# EAGLE schematic apvtv_draft1 (EAGLE 8.5.2)
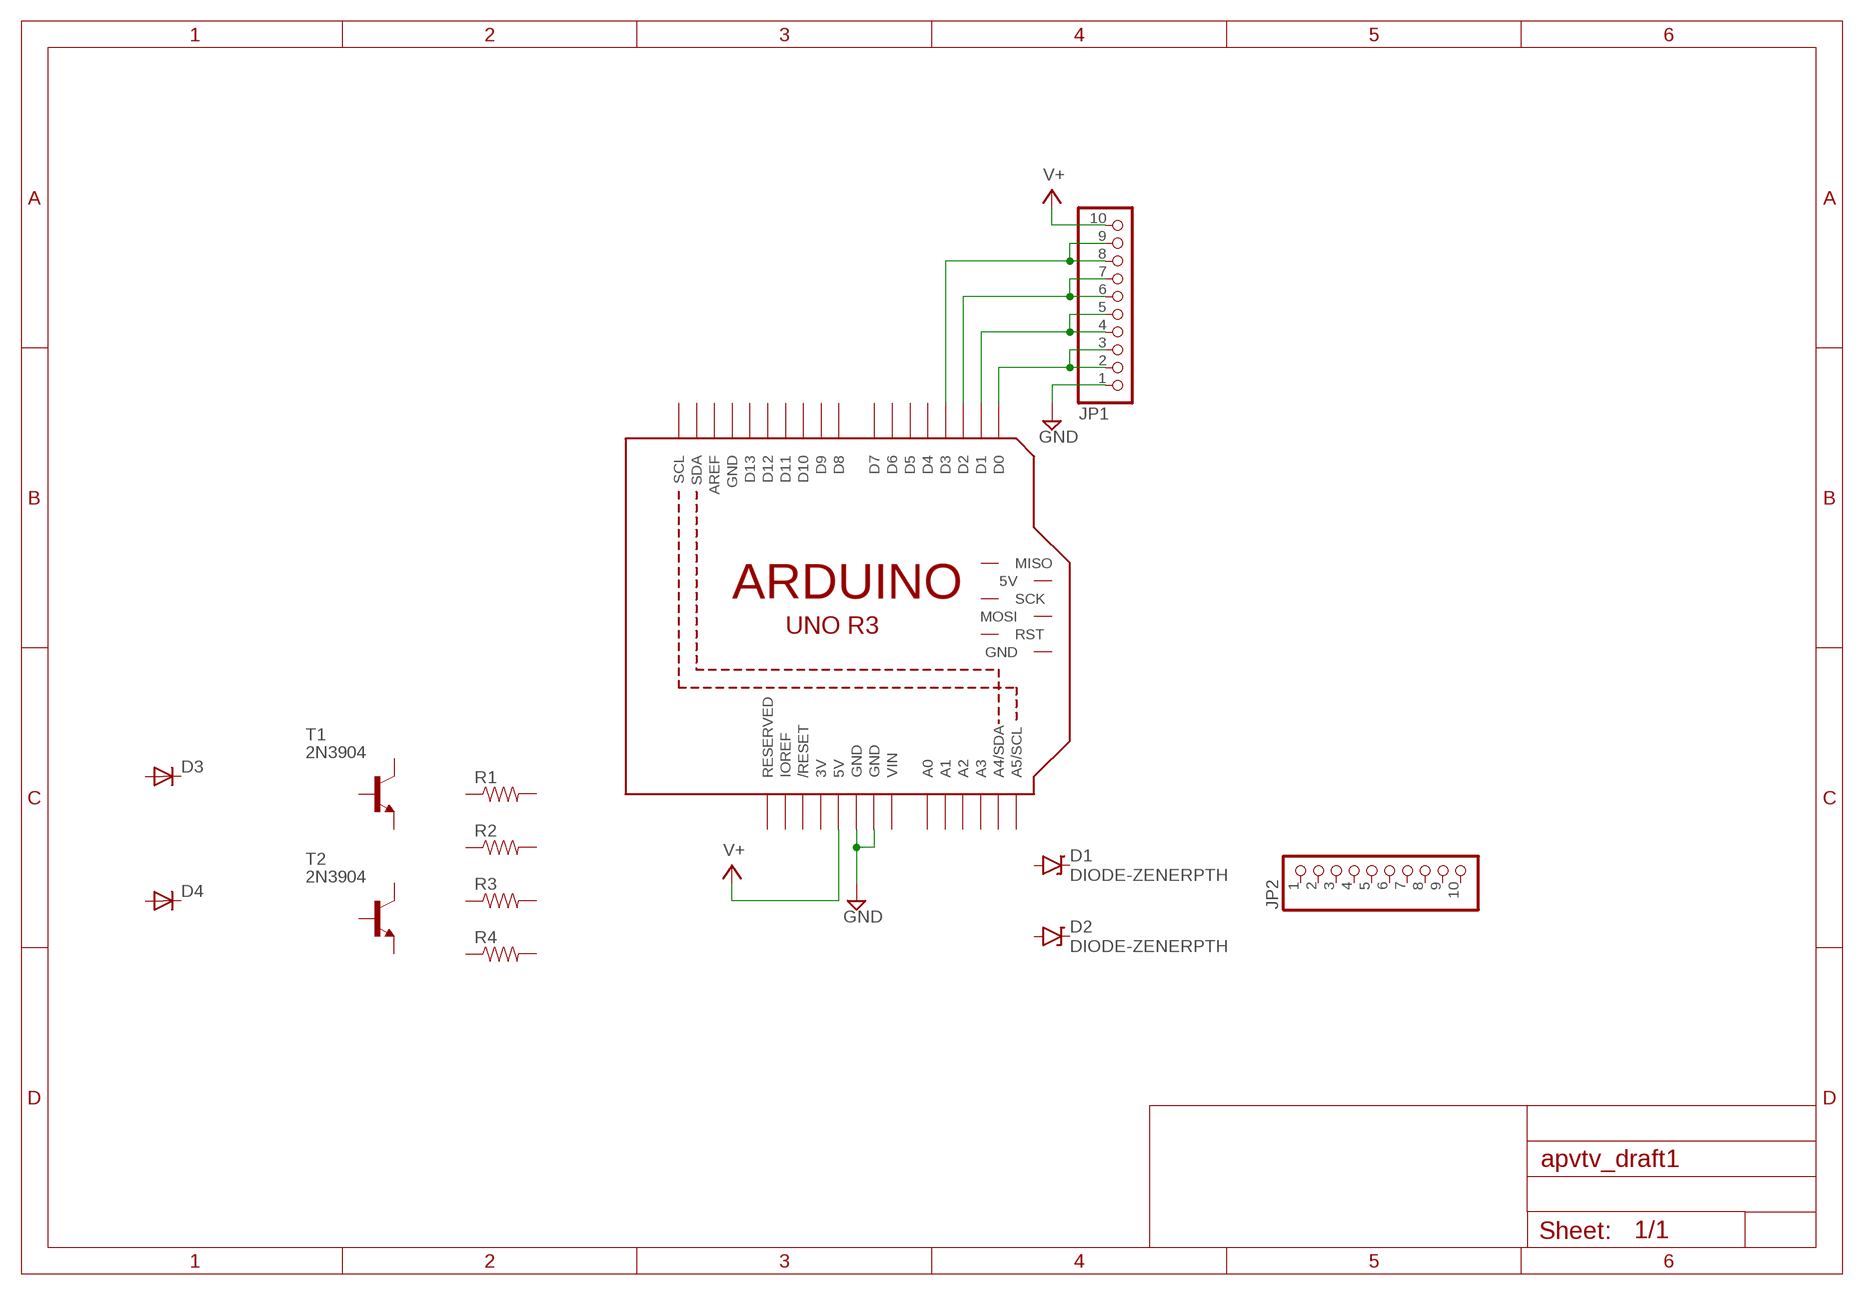
[diagram p0: schematic, sheet 1]

## Parts
D1  DIODE-ZENERPTH  [DIODE-ZENER]
D2  DIODE-ZENERPTH  [DIODE-ZENER]
D3  SMALL_DIODEDO35-7  [DO35-7]
D4  SMALL_DIODEDO35-7  [DO35-7]
JP1  PINHD-1X10  [1X10]
JP2  PINHD-1X10  [1X10]
M1  ARDUINO_R3_ICSP  [ARDUINOR3_ICSP]
R1  RESISTORPTH-1/4W  [AXIAL-0.4]
R2  RESISTORPTH-1/4W  [AXIAL-0.4]
R3  RESISTORPTH-1/4W  [AXIAL-0.4]
R4  RESISTORPTH-1/4W  [AXIAL-0.4]
T1  2N3904  [TO92]
T2  2N3904  [TO92]

## Nets
GND: JP1.1 M1.GND@1(GND) M1.GND@3(GND)
N$4: JP1.2 JP1.3 M1.D0
N$5: JP1.4 JP1.5 M1.D1
N$6: JP1.6 JP1.7 M1.D2
N$7: JP1.8 JP1.9 M1.D3
V+: JP1.10 M1.5V
Unconnected: D1.P$1(C) D1.P$2(A) D2.P$1(C) D2.P$2(A) D3.A D3.C D4.A D4.C JP2.1 JP2.2 JP2.3 JP2.4 JP2.5 JP2.6 JP2.7 JP2.8 JP2.9 JP2.10 M1.5V_ICSP(5V) M1.A0 M1.A1 M1.A2 M1.A3 M1.A4(A4/SDA) M1.A5(A5/SCL) M1.AREF M1.D4 M1.D5 M1.D6 M1.D7 M1.D8 M1.D9 M1.D10 M1.D11 M1.D12 M1.D13 M1.GND@2(GND) M1.IOREF M1.MISO M1.MOSI M1.RESERVED M1.RESET(/RESET) M1.RESET_ICSP(RST) M1.SCK M1.SCL M1.SDA R1.P$1 R1.P$2 R2.P$1 R2.P$2 R3.P$1 R3.P$2 R4.P$1 R4.P$2 T1.1(C) T1.2(B) T1.3(E) T2.1(C) T2.2(B) T2.3(E)

## Power pins joined to a net without a drawn wire
3V: M1.3V
GND: M1.GND
VIN: M1.VIN

## Library data of the parts
D1 D2 = SparkFun-DiscreteSemi:DIODE-ZENER: Zener Diode Production Part - 8199 3.4V Zener Voltage
D3 D4 = MusicThingModular:SMALL_DIODE: Small Signal Diode
JP1 JP2 = pinhead:PINHD-1X10: PIN HEADER
M1 = adafruit:ARDUINO_R3_ICSP
R1-R4 = SparkFun-Passives:RESISTOR: Resistor Basic schematic elements and footprints for 0603, 1206, and PTH resistors.
T1 T2 = transistor:2N3904: NPN TRANSISTOR